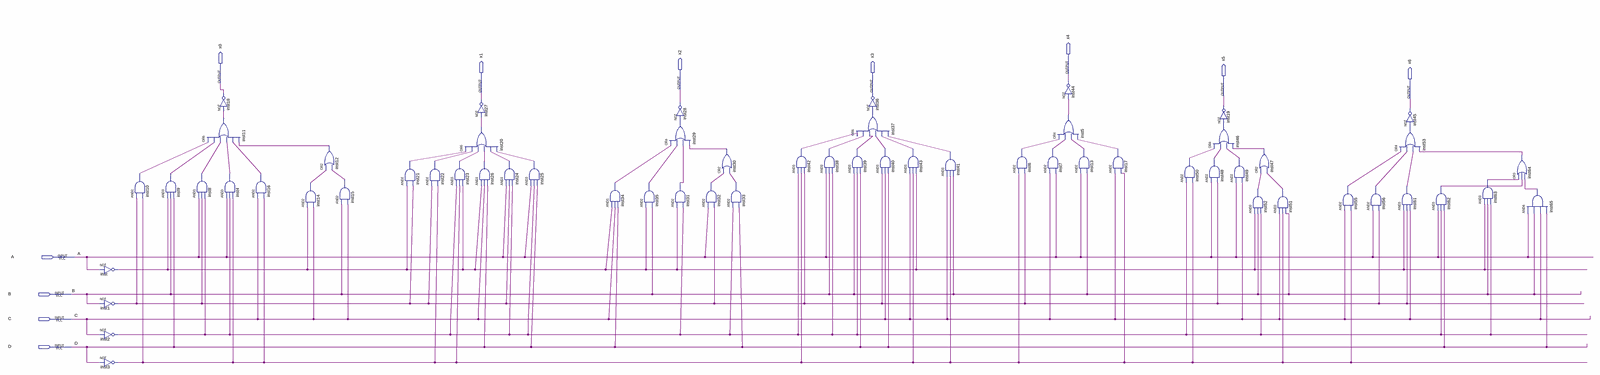
[diagram p0: schematic sheet, whole]
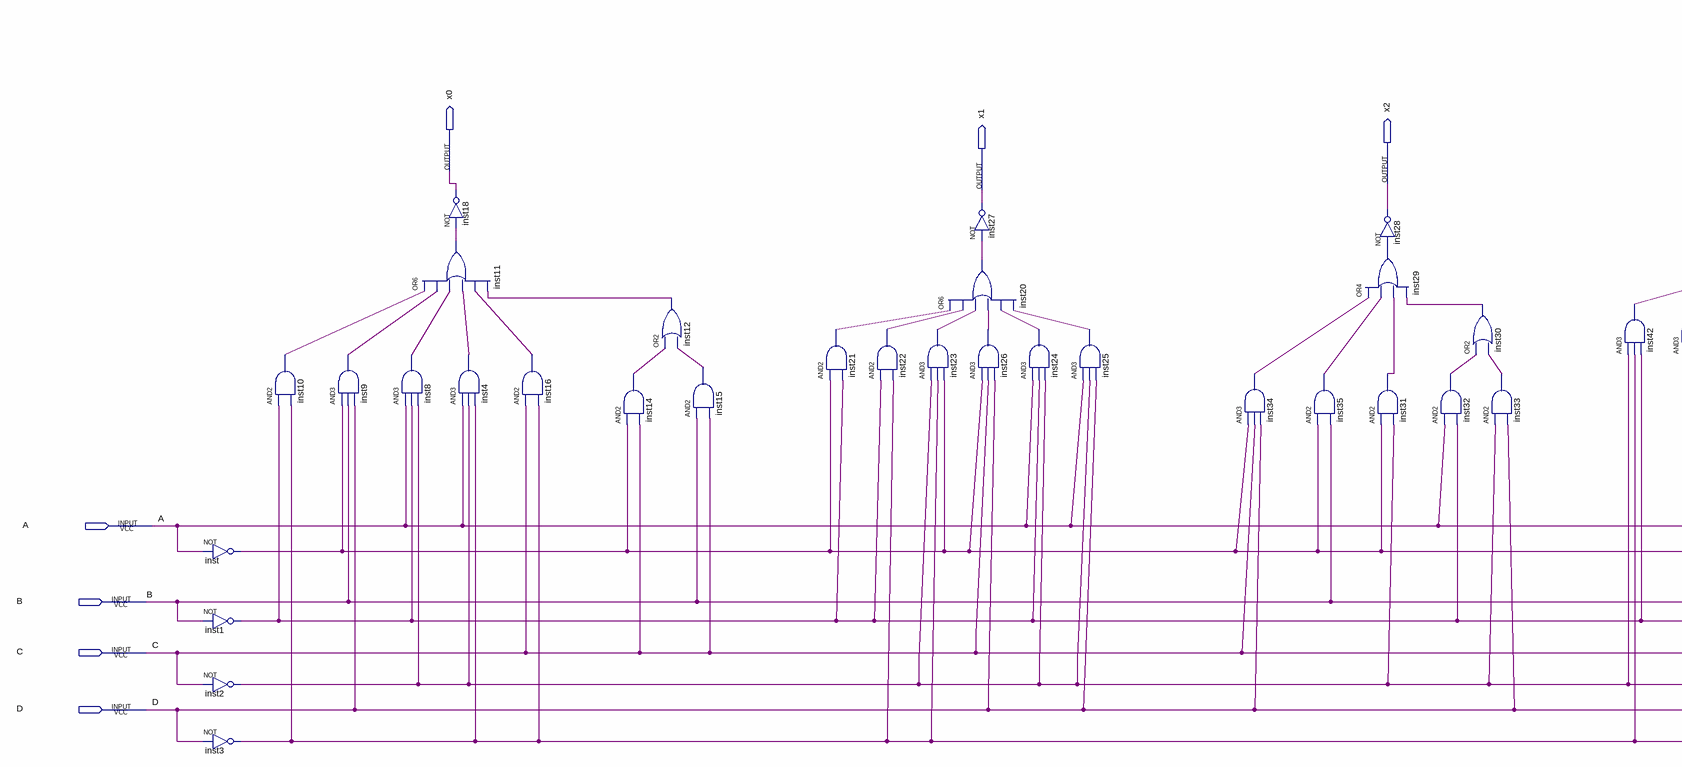
[diagram p1: schematic sheet, left part]
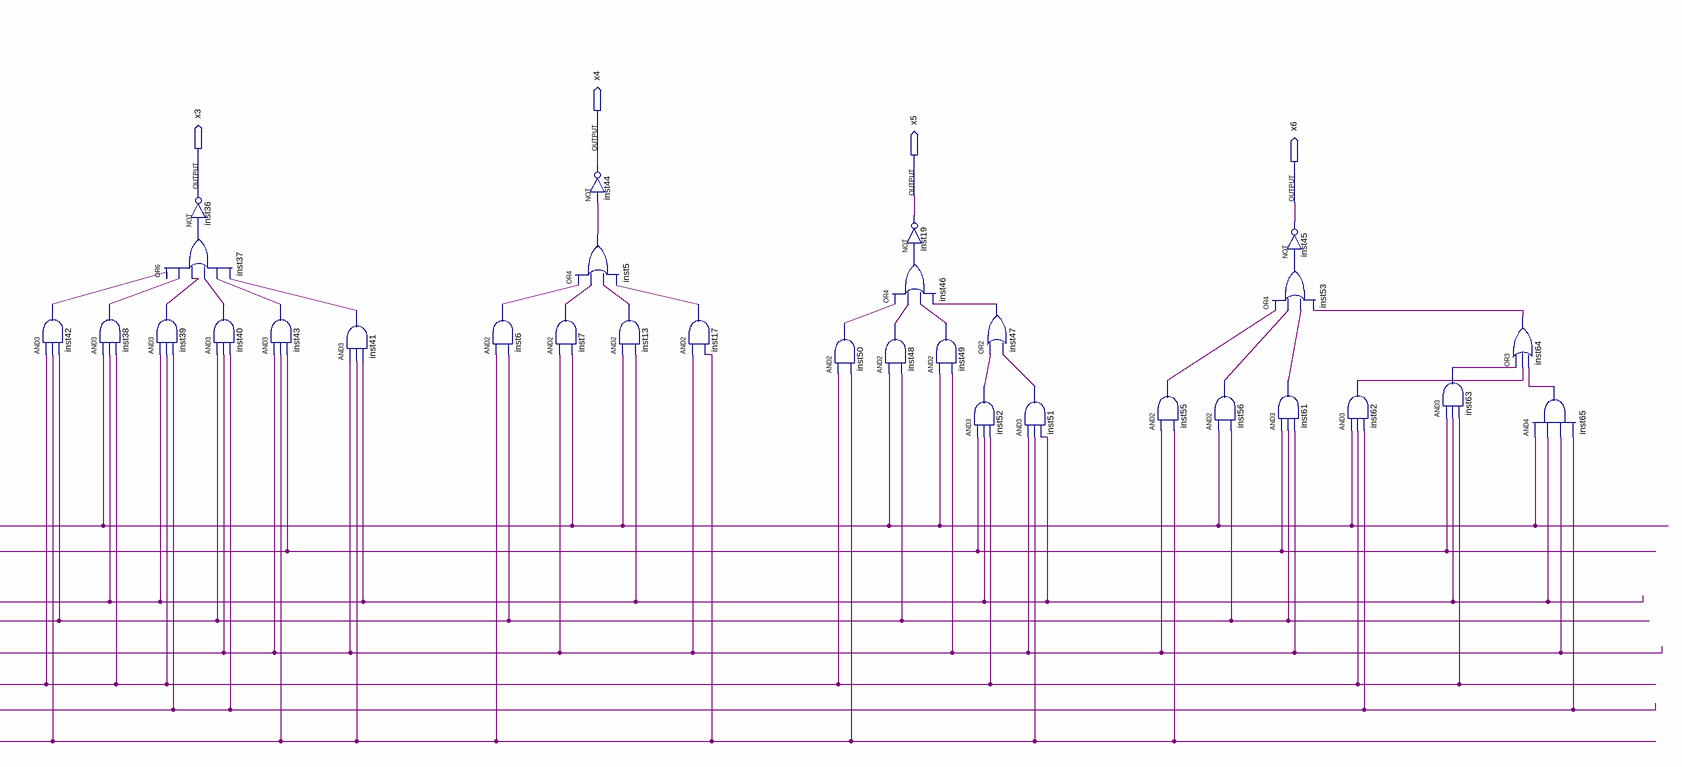
[diagram p2: schematic sheet, right part]
// Quartus schematic Block3.bdf as structural Verilog: 61 symbols, 11 pins
module Block3 (
  input  A,
  input  B,
  input  C,
  input  D,
  output x4,
  output x0,
  output x2,
  output x1,
  output x3,
  output x5,
  output x6
);

  wire inst1_out, inst2_out, inst3_out, inst4_out, inst5_out, inst6_out, inst7_out, inst8_out, inst9_out,
       inst10_out, inst11_out, inst12_out, inst13_out, inst14_out, inst15_out, inst16_out, inst17_out,
       inst20_out, inst21_out, inst22_out, inst23_out, inst24_out, inst25_out, inst26_out, inst29_out,
       inst30_out, inst31_out, inst32_out, inst33_out, inst34_out, inst35_out, inst37_out, inst38_out,
       inst39_out, inst40_out, inst41_out, inst42_out, inst43_out, inst46_out, inst47_out, inst48_out,
       inst49_out, inst50_out, inst51_out, inst52_out, inst53_out, inst55_out, inst56_out, inst61_out,
       inst62_out, inst63_out, inst64_out, inst65_out, inst_out;

  not inst (inst_out, A);
  not inst1 (inst1_out, B);
  not inst2 (inst2_out, C);
  not inst3 (inst3_out, D);
  and inst10 (inst10_out, inst1_out, inst3_out);
  and inst9 (inst9_out, inst_out, B, D);
  or inst11 (inst11_out, inst10_out, inst9_out, inst8_out, inst4_out, inst16_out, inst12_out);
  and inst8 (inst8_out, A, inst1_out, inst2_out);
  not inst18 (x0, inst11_out);
  and inst4 (inst4_out, A, inst2_out, inst3_out);
  and inst16 (inst16_out, C, inst3_out);
  and inst14 (inst14_out, inst_out, C);
  or inst12 (inst12_out, inst14_out, inst15_out);
  and inst15 (inst15_out, B, C);
  and inst21 (inst21_out, inst_out, inst1_out);
  and inst22 (inst22_out, inst1_out, inst3_out);
  and inst23 (inst23_out, inst2_out, inst3_out, inst_out);
  not inst27 (x1, inst20_out);
  or inst20 (inst20_out, inst21_out, inst22_out, inst23_out, inst26_out, inst24_out, inst25_out);
  and inst26 (inst26_out, inst_out, C, D);
  and inst24 (inst24_out, A, inst1_out, inst2_out);
  and inst25 (inst25_out, A, inst2_out, D);
  and inst34 (inst34_out, inst_out, C, D);
  and inst35 (inst35_out, inst_out, B);
  not inst28 (x2, inst29_out);
  or inst29 (inst29_out, inst34_out, inst35_out, inst31_out, inst30_out);
  and inst31 (inst31_out, inst_out, inst2_out);
  and inst32 (inst32_out, A, inst1_out);
  or inst30 (inst30_out, inst32_out, inst33_out);
  and inst33 (inst33_out, inst2_out, D);
  and inst42 (inst42_out, inst2_out, inst3_out, inst1_out);
  and inst38 (inst38_out, A, B, inst2_out);
  or inst37 (inst37_out, inst42_out, inst38_out, inst39_out, inst40_out, inst43_out, inst41_out);
  and inst39 (inst39_out, B, inst2_out, D);
  not inst36 (x3, inst37_out);
  and inst40 (inst40_out, inst1_out, C, D);
  and inst43 (inst43_out, C, inst3_out, inst_out);
  and inst41 (inst41_out, C, inst3_out, B);
  and inst6 (inst6_out, inst3_out, inst1_out);
  and inst7 (inst7_out, C, A);
  not inst44 (x4, inst5_out);
  or inst5 (inst5_out, inst6_out, inst7_out, inst13_out, inst17_out);
  and inst13 (inst13_out, A, B);
  and inst17 (inst17_out, C, inst3_out);
  and inst50 (inst50_out, inst2_out, inst3_out);
  not inst19 (x5, inst46_out);
  or inst46 (inst46_out, inst50_out, inst48_out, inst49_out, inst47_out);
  and inst48 (inst48_out, A, inst1_out);
  and inst49 (inst49_out, A, C);
  and inst52 (inst52_out, inst_out, B, inst2_out);
  or inst47 (inst47_out, inst52_out, inst51_out);
  and inst51 (inst51_out, C, inst3_out, B);
  and inst55 (inst55_out, C, inst3_out);
  and inst56 (inst56_out, A, inst1_out);
  or inst53 (inst53_out, inst55_out, inst56_out, inst61_out, inst64_out);
  and inst61 (inst61_out, inst_out, inst1_out, C);
  not inst45 (x6, inst53_out);
  and inst62 (inst62_out, A, inst2_out, D);
  and inst63 (inst63_out, inst_out, B, inst2_out);
  or inst64 (inst64_out, inst63_out, inst62_out, inst65_out);
  and inst65 (inst65_out, A, B, C, D);
endmodule
